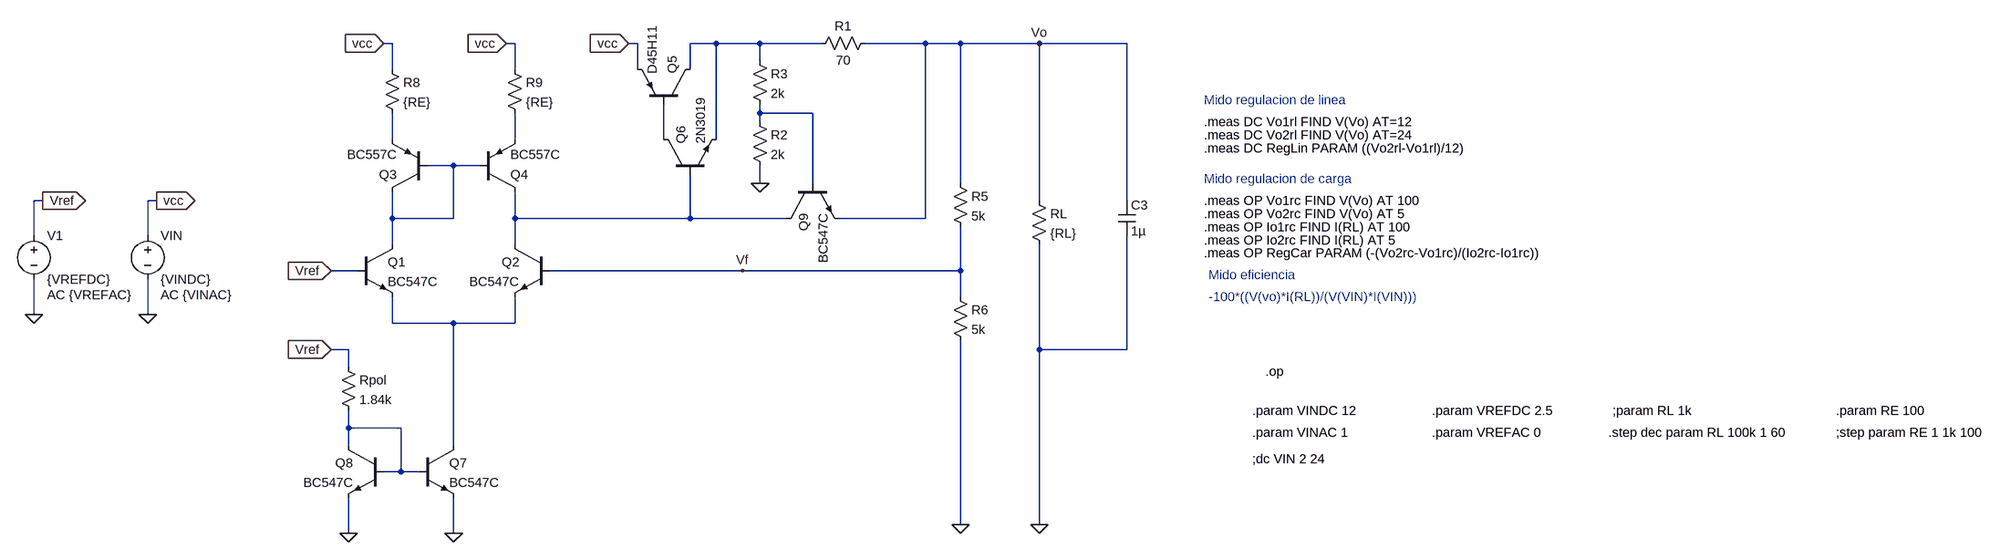
[diagram p0: schematic Version 1.5.asc]
Version 1.5.asc, the LTspice schematic file:
Version 4
SHEET 1 3148 1188
WIRE 96 -128 80 -128
WIRE 320 -128 304 -128
WIRE 544 -128 528 -128
WIRE 688 -128 640 -128
WIRE 768 -128 688 -128
WIRE 880 -128 768 -128
WIRE 1072 -128 960 -128
WIRE 1136 -128 1072 -128
WIRE 1280 -128 1136 -128
WIRE 1440 -128 1280 -128
WIRE 768 -96 768 -128
WIRE 96 -80 96 -128
WIRE 320 -80 320 -128
WIRE 544 -80 544 -128
WIRE 640 -80 640 -128
WIRE 768 0 768 -16
WIRE 864 0 768 0
WIRE 768 16 768 0
WIRE 96 48 96 0
WIRE 320 48 320 0
WIRE 592 48 592 -16
WIRE 688 48 688 -128
WIRE 208 96 160 96
WIRE 256 96 208 96
WIRE 768 128 768 96
WIRE 864 128 864 0
WIRE 1136 128 1136 -128
WIRE -1008 160 -1024 160
WIRE -800 160 -816 160
WIRE 1280 160 1280 -128
WIRE 1440 160 1440 -128
WIRE 96 192 96 144
WIRE 208 192 208 96
WIRE 208 192 96 192
WIRE 320 192 320 144
WIRE 640 192 640 112
WIRE 640 192 320 192
WIRE 816 192 640 192
WIRE 1072 192 1072 -128
WIRE 1072 192 912 192
WIRE -1024 224 -1024 160
WIRE -816 224 -816 160
WIRE 96 240 96 192
WIRE 320 240 320 192
WIRE 32 288 -16 288
WIRE 736 288 384 288
WIRE 1136 288 1136 208
WIRE 1136 288 736 288
WIRE 1136 336 1136 288
WIRE -1024 368 -1024 304
WIRE -816 368 -816 304
WIRE 96 384 96 336
WIRE 208 384 96 384
WIRE 320 384 320 336
WIRE 320 384 208 384
WIRE 16 432 -16 432
WIRE 1280 432 1280 240
WIRE 1440 432 1440 224
WIRE 1440 432 1280 432
WIRE 16 464 16 432
WIRE 16 576 16 544
WIRE 112 576 16 576
WIRE 16 608 16 576
WIRE 208 608 208 384
WIRE 112 656 112 576
WIRE 112 656 80 656
WIRE 144 656 112 656
WIRE 1136 752 1136 416
WIRE 1280 752 1280 432
WIRE 16 768 16 704
WIRE 208 768 208 704
FLAG 1280 -128 Vo
FLAG -1008 160 Vref
IOPIN -1008 160 Out
FLAG 736 288 Vf
FLAG -1024 368 0
FLAG -800 160 vcc
IOPIN -800 160 Out
FLAG 1280 752 0
FLAG 1136 752 0
FLAG -16 288 Vref
IOPIN -16 288 In
FLAG -16 432 Vref
IOPIN -16 432 In
FLAG -816 368 0
FLAG 16 768 0
FLAG 208 768 0
FLAG 80 -128 vcc
IOPIN 80 -128 In
FLAG 304 -128 vcc
IOPIN 304 -128 In
FLAG 528 -128 vcc
IOPIN 528 -128 In
FLAG 768 128 0
DATAFLAG 1104 -32 ""
SYMBOL pnp 160 144 R180
SYMATTR InstName Q3
SYMATTR Value BC557C
SYMBOL pnp 256 144 M180
SYMATTR InstName Q4
SYMATTR Value BC557C
SYMBOL npn 32 240 R0
SYMATTR InstName Q1
SYMATTR Value BC547C
SYMBOL npn 384 240 M0
SYMATTR InstName Q2
SYMATTR Value BC547C
SYMBOL pnp 640 -16 M270
SYMATTR InstName Q5
SYMATTR Value D45H11
SYMBOL npn 592 112 R270
SYMATTR InstName Q6
SYMATTR Value 2N3019
SYMBOL res 1120 112 R0
SYMATTR InstName R5
SYMATTR Value 5k
SYMBOL res 1120 320 R0
SYMATTR InstName R6
SYMATTR Value 5k
SYMBOL res 1264 144 R0
SYMATTR InstName RL
SYMATTR Value {RL}
SYMBOL voltage -1024 208 R0
WINDOW 123 24 124 Left 2
WINDOW 39 0 0 Left 0
SYMATTR Value2 AC {VREFAC}
SYMATTR InstName V1
SYMATTR Value {VREFDC}
SYMBOL res 80 -96 R0
SYMATTR InstName R8
SYMATTR Value {RE}
SYMBOL res 304 -96 R0
SYMATTR InstName R9
SYMATTR Value {RE}
SYMBOL cap 1424 160 R0
SYMATTR InstName C3
SYMATTR Value 1µ
SYMBOL voltage -816 208 R0
WINDOW 123 24 124 Left 2
WINDOW 39 0 0 Left 0
SYMATTR Value2 AC {VINAC}
SYMATTR InstName VIN
SYMATTR Value {VINDC}
SYMBOL npn 144 608 R0
SYMATTR InstName Q7
SYMATTR Value BC547C
SYMBOL npn 80 608 M0
SYMATTR InstName Q8
SYMATTR Value BC547C
SYMBOL res 0 448 R0
SYMATTR InstName Rpol
SYMATTR Value 1.84k
SYMBOL npn 816 128 M90
SYMATTR InstName Q9
SYMATTR Value BC547C
SYMBOL res 976 -144 R90
WINDOW 0 0 56 VBottom 2
WINDOW 3 32 56 VTop 2
SYMATTR InstName R1
SYMATTR Value 70
SYMBOL res 752 0 R0
SYMATTR InstName R2
SYMATTR Value 2k
SYMBOL res 752 -112 R0
SYMATTR InstName R3
SYMATTR Value 2k
TEXT 1760 472 Left 2 !.op
TEXT 1736 544 Left 2 !.param VINDC 12
TEXT 1736 584 Left 2 !.param VINAC 1
TEXT 2064 544 Left 2 !.param VREFDC 2.5
TEXT 2064 584 Left 2 !.param VREFAC 0
TEXT 2408 544 Left 2 !;param RL 1k
TEXT 1736 632 Left 2 !;dc VIN 2 24
TEXT 2816 584 Left 2 !;step param RE 1 1k 100
TEXT 2816 544 Left 2 !.param RE 100
TEXT 2400 584 Left 2 !.step dec param RL 100k 1 60
TEXT 1648 -24 Left 2 ;Mido regulacion de linea
TEXT 1648 16 Left 2 !.meas DC Vo1rl FIND V(Vo) AT=12
TEXT 1648 40 Left 2 !.meas DC Vo2rl FIND V(Vo) AT=24
TEXT 1648 64 Left 2 !.meas DC RegLin PARAM ((Vo2rl-Vo1rl)/12)
TEXT 1648 120 Left 2 ;Mido regulacion de carga
TEXT 1648 160 Left 2 !.meas OP Vo1rc FIND V(Vo) AT 100
TEXT 1648 184 Left 2 !.meas OP Vo2rc FIND V(Vo) AT 5
TEXT 1648 208 Left 2 !.meas OP Io1rc FIND I(RL) AT 100
TEXT 1648 232 Left 2 !.meas OP Io2rc FIND I(RL) AT 5
TEXT 1656 296 Left 2 ;Mido eficiencia
TEXT 1656 336 Left 2 ;-100*((V(vo)*I(RL))/(V(VIN)*I(VIN)))
TEXT 1648 256 Left 2 !.meas OP RegCar PARAM (-(Vo2rc-Vo1rc)/(Io2rc-Io1rc))

The netlist it stands for:
* Version 1.5.asc
Q3 N006 N006 N003 0 BC557C
Q4 N007 N006 N004 0 BC557C
Q1 N006 Vref N008 0 BC547C
Q2 N007 Vf N008 0 BC547C
Q5 N001 N005 vcc 0 D45H11
Q6 N005 N007 N001 0 2N3019
R5 Vo Vf 5k
R6 Vf 0 5k
RL Vo 0 {RL}
V1 Vref 0 {VREFDC} AC {VREFAC}
R8 vcc N003 {RE}
R9 vcc N004 {RE}
C3 Vo 0 1µ
VIN vcc 0 {VINDC} AC {VINAC}
Q7 N008 N009 0 0 BC547C
Q8 N009 N009 0 0 BC547C
Rpol Vref N009 1.84k
Q9 N007 N002 Vo 0 BC547C
R1 Vo N001 70
R2 N002 0 2k
R3 N001 N002 2k
.model NPN NPN
.model PNP PNP
.lib standard.bjt
.op
.param VINDC 12
.param VINAC 1
.param VREFDC 2.5
.param VREFAC 0
;param RL 1k
;dc VIN 2 24
;step param RE 1 1k 100
.param RE 100
.step dec param RL 100k 1 60
* Mido regulacion de linea
.meas DC Vo1rl FIND V(Vo) AT=12
.meas DC Vo2rl FIND V(Vo) AT=24
.meas DC RegLin PARAM ((Vo2rl-Vo1rl)/12)
* Mido regulacion de carga
.meas OP Vo1rc FIND V(Vo) AT 100
.meas OP Vo2rc FIND V(Vo) AT 5
.meas OP Io1rc FIND I(RL) AT 100
.meas OP Io2rc FIND I(RL) AT 5
* Mido eficiencia
* -100*((V(vo)*I(RL))/(V(VIN)*I(VIN)))
.meas OP RegCar PARAM (-(Vo2rc-Vo1rc)/(Io2rc-Io1rc))
.backanno
.end

* Results of the author's LTspice run, read from the files saved beside the schematic
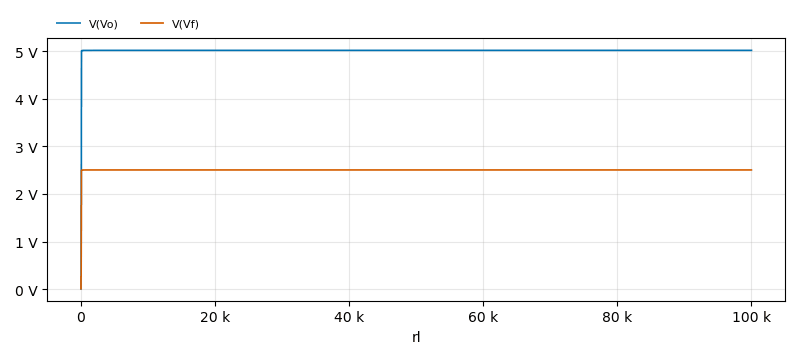
[diagram p1: Operating Point of Version 1.5.asc, plotted from the saved traces]
* Operating Point, 1 run:
*   V(Vo): 19.27 mV at rl=1 , 5.014 V at rl=100 k, min 19.27 mV, max 5.014 V
*   V(Vf): 9.637 mV at rl=1 , 2.504 V at rl=100 k, min 9.637 mV, max 2.504 V
* From the log:
*   Semiconductor Device Operating Points:
*                           --- Bipolar Transistors ---
*   Name:       q6          q5          q9          q8          q7
*   Model:    2n3019      d45h11      bc547c      bc547c      bc547c
*   Ib:       6.53e-07   -1.43e-04    2.39e-06    2.25e-06    2.25e-06
*   Ic:       1.43e-04   -1.83e-02    1.10e-03    1.02e-03    1.04e-03
*   Vbe:      5.94e-01   -4.10e-01    6.24e-01    6.22e-01    6.22e-01
*   Vbc:     -9.71e+00    1.03e+01   -1.24e+00    0.00e+00   -1.26e+00
*   Vce:      1.03e+01   -1.07e+01    1.87e+00    6.22e-01    1.88e+00
*   BetaDC:   2.19e+02    1.28e+02    4.63e+02    4.52e+02    4.63e+02
*   Gm:       5.53e-03    8.32e-01    4.19e-02    3.86e-02    3.95e-02
*   Rpi:      3.96e+04    1.54e+02    1.10e+04    1.17e+04    1.17e+04
*   Rx:       1.00e+01    2.35e+00    1.00e+00    1.00e+00    1.00e+00
*   Ro:       7.66e+05    1.13e+03    4.87e+04    5.17e+04    5.17e+04
*   Cbe:      7.12e-11    4.69e-09    5.17e-11    5.00e-11    5.05e-11
*   Cbc:      6.20e-12    1.84e-10    1.58e-12    2.74e-12    1.57e-12
*   Cjs:      0.00e+00    0.00e+00    0.00e+00    0.00e+00    0.00e+00
*   BetaAC:   2.19e+02    1.28e+02    4.60e+02    4.50e+02    4.60e+02
*   Cbx:      0.00e+00    4.50e-11    9.71e-13    1.69e-12    9.68e-13
*   Ft:       1.14e+07    2.69e+07    1.23e+08    1.13e+08    1.19e+08
*   Name:       q2          q1          q4          q3
*   Model:    bc547c      bc547c      bc557c      bc557c
*   Ib:      -3.78e-12    1.97e-06   -1.78e-06   -2.33e-06
*   Ic:       1.90e-12    1.04e-03   -1.11e-03   -1.03e-03
*   Vbe:     -1.87e+00    6.19e-01   -6.12e-01   -6.19e-01
*   Vbc:     -1.88e+00   -8.78e+00    9.39e+00    0.00e+00
*   Vce:      3.65e-03    9.40e+00   -1.00e+01   -6.19e-01
*   BetaDC:  -5.04e-01    5.28e+02    6.21e+02    4.44e+02
*   Gm:      -8.96e-44    3.95e-02    4.17e-02    3.89e-02
*   Rpi:      1.00e+12    1.33e+04    1.48e+04    1.13e+04
*   Rx:       1.00e+00    1.00e+00    1.00e+00    1.00e+00
*   Ro:       4.29e+42    5.91e+04    2.99e+04    2.29e+04
*   Cbe:      7.47e-12    5.02e-11    5.35e-11    5.23e-11
*   Cbc:      1.43e-12    9.49e-13    1.35e-12    4.91e-12
*   Cjs:      0.00e+00    0.00e+00    0.00e+00    0.00e+00
*   BetaAC:  -8.96e-32    5.26e+02    6.20e+02    4.41e+02
*   Cbx:      8.77e-13    5.84e-13    7.95e-13    2.90e-12
*   Ft:       1.63e-02    1.21e+08    1.19e+08    1.03e+08
*   vo1rc: v(vo)=5.00802 at 100
*   vo2rc: v(vo)=0.102238 at 5
*   io1rc: i(rl)=0.0500802 at 100
*   io2rc: i(rl)=0.0204475 at 5
*   regcar: (-(vo2rc-vo1rc)/(io2rc-io1rc))=-165.553